# EAGLE design proto (EAGLE 8.7.0)
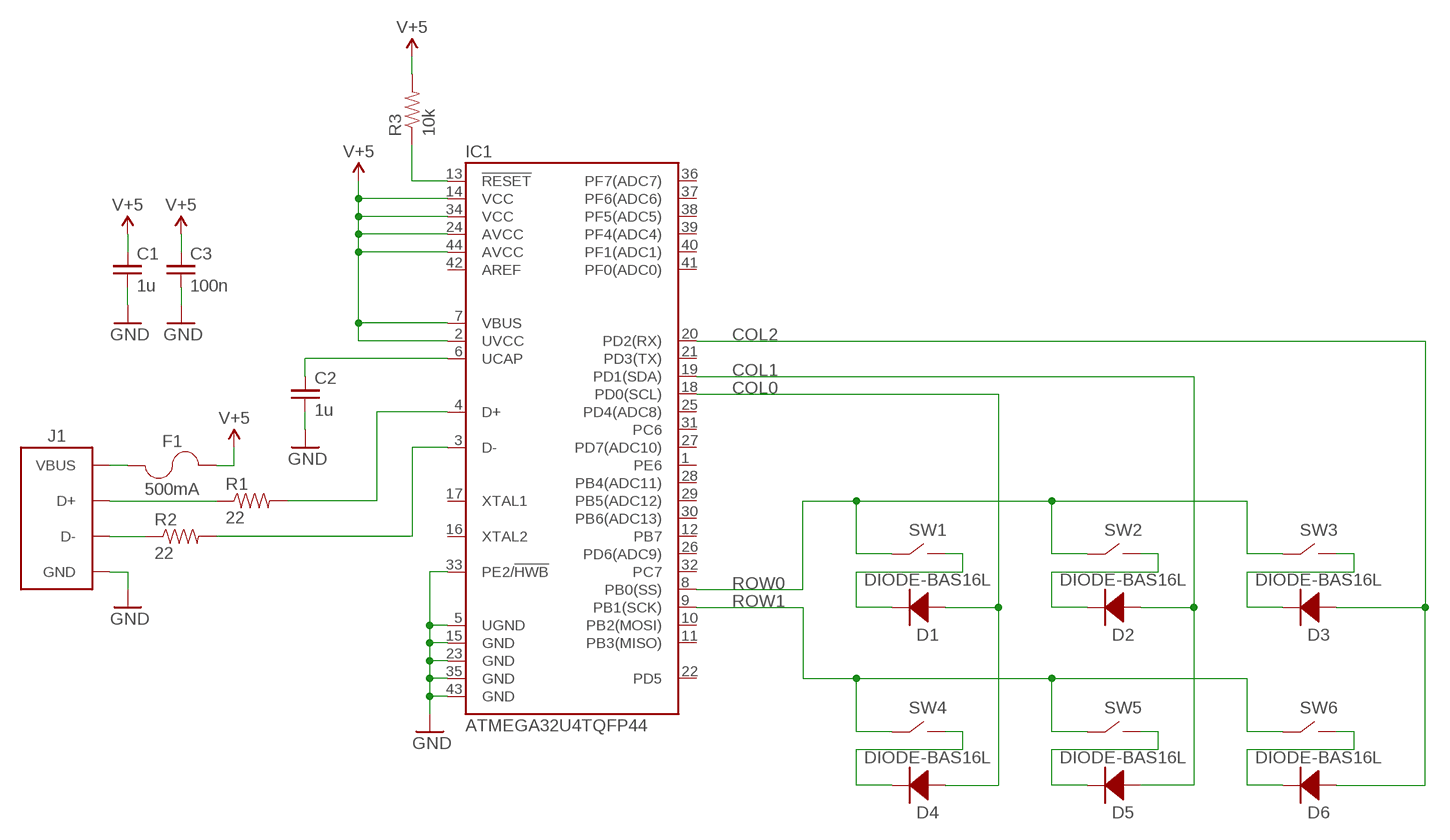
[diagram p0: schematic, sheet 1]

## Parts
C1  1u  CAP-0805  [0805]
C2  1u  CAP-0805  [0805]
C3  100n  CAP-0805  [0805]
D1  DIODE-BAS16L  [SOT23-3]
D2  DIODE-BAS16L  [SOT23-3]
D3  DIODE-BAS16L  [SOT23-3]
D4  DIODE-BAS16L  [SOT23-3]
D5  DIODE-BAS16L  [SOT23-3]
D6  DIODE-BAS16L  [SOT23-3]
F1  500mA  FUSE  [0805]
IC1  ATMEGA32U4TQFP44  [QFP80P1200X1225X120-44]
J1  USB2.0-C  [USB-C]
R1  22  RESISTOR-0805  [0805]
R2  22  RESISTOR-0805  [0805]
R3  10k  RESISTOR-0805  [0805]
SW1  SWITCH-SPSTCHERRY  [CHERRY-MX]
SW2  SWITCH-SPSTCHERRY  [CHERRY-MX]
SW3  SWITCH-SPSTCHERRY  [CHERRY-MX]
SW4  SWITCH-SPSTCHERRY  [CHERRY-MX]
SW5  SWITCH-SPSTCHERRY  [CHERRY-MX]
SW6  SWITCH-SPSTCHERRY  [CHERRY-MX]

## Nets
COL0: D1.1(ANODE+) D4.1(ANODE+) IC1.18(PD0(SCL))
COL1: D2.1(ANODE+) D5.1(ANODE+) IC1.19(PD1(SDA))
COL2: D3.1(ANODE+) D6.1(ANODE+) IC1.20(PD2(RX))
GND: C1.2 C2.2 C3.2 IC1.5(UGND) IC1.15(GND) IC1.23(GND) IC1.33(PE2/!HWB) IC1.35(GND) IC1.43(GND) J1.GND@1(GND) J1.GND@2(GND) J1.GND@3(GND) J1.GND@4(GND) J1.GND@5(GND) J1.GND@6(GND) J1.GND@7(GND) J1.GND@8(GND) J1.GND@9(GND) J1.GND@10(GND) J1.GND@11(GND) J1.GND@12(GND) J1.GND@13(GND) J1.GND@14(GND) J1.GND@15(GND) J1.GND@16(GND)
N$1: J1.D+@1(D+) J1.D+@2(D+) R1.1
N$2: J1.D-@1(D-) J1.D-@2(D-) R2.1
N$3: F1.1 J1.VBUS@1(VBUS) J1.VBUS@2(VBUS) J1.VBUS@3(VBUS) J1.VBUS@4(VBUS)
N$4: C2.1 IC1.6(UCAP)
N$5: IC1.4(D+) R1.2
N$6: IC1.3(D-) R2.2
N$7: IC1.13(!RESET) R3.1
N$8: D1.3(CATHODE-) SW1.P$2
N$9: D2.3(CATHODE-) SW2.P$2
N$10: D3.3(CATHODE-) SW3.P$2
N$11: D4.3(CATHODE-) SW4.P$2
N$12: D5.3(CATHODE-) SW5.P$2
N$13: D6.3(CATHODE-) SW6.P$2
ROW0: IC1.8(PB0(SS)) SW1.P$1 SW2.P$1 SW3.P$1
ROW1: IC1.9(PB1(SCK)) SW4.P$1 SW5.P$1 SW6.P$1
V+5: C1.1 C3.1 F1.2 IC1.2(UVCC) IC1.7(VBUS) IC1.14(VCC) IC1.24(AVCC) IC1.34(VCC) IC1.44(AVCC) R3.2
Unconnected: IC1.1(PE6) IC1.10(PB2(MOSI)) IC1.11(PB3(MISO)) IC1.12(PB7) IC1.16(XTAL2) IC1.17(XTAL1) IC1.21(PD3(TX)) IC1.22(PD5) IC1.25(PD4(ADC8)) IC1.26(PD6(ADC9)) IC1.27(PD7(ADC10)) IC1.28(PB4(ADC11)) IC1.29(PB5(ADC12)) IC1.30(PB6(ADC13)) IC1.31(PC6) IC1.32(PC7) IC1.36(PF7(ADC7)) IC1.37(PF6(ADC6)) IC1.38(PF5(ADC5)) IC1.39(PF4(ADC4)) IC1.40(PF1(ADC1)) IC1.41(PF0(ADC0)) IC1.42(AREF)

## Library data of the parts
C1-C3 = passives:CAP: AC capacitor 0805 <http://www.digikey.com/product-search/en/capacitors/ceramic-capacitors/131083?k=&pv17=18&pv17=5&FV=fffc04fc%2C1c0002%2C380020%2C400006%2C11401c5%2C6540013%2Cfff40002%2Cfff8000b&mnonly=0&newproducts=0&ColumnSort=1000011&page=1&stock=1&pbfree=1&rohs=1&quantity=1&ptm=0&fid=0&pageSize=500>
D1-D6 = discrete:DIODE-BAS16L
F1 = passives:FUSE: LED 500mA SMD 0805 Vishay Beyschlag MFU0805FF00500P100 MFU0805.50CT-ND <https://www.digikey.com/products/en/circuit-protection/fuses/139?k=&pkeyword=&pv16=6&FV=1140003%2Cmu500mA%7C2088%2Cffe0008b%2C1c0002&quantity=0&ColumnSort=0&page=1&stock=1&pageSize=500>
IC1 = ICs:ATMEGA32U4
J1 = connector:USB2.0-C
R1-R3 = passives:RESISTOR: Resistor 0805 <http://www.digikey.com/product-search/en/resistors/chip-resistor-surface-mount/65769?FV=fffc000a%2C80005%2Cc0002%2C1c0002%2C400006%2C52403b5%2Cfff40001%2Cfff800e9&mnonly=0&newproducts=0&ColumnSort=1000011&page=1&stock=1&pbfree=1&rohs=1&k=&quantity=1&ptm=0&fid=0&pageSize=500>
SW1-SW6 = passives:SWITCH-SPST: Small push button switch TE Connectivity Alcoswitch Switches 1825910-6 450-1650-ND <http://www.digikey.com/product-detail/en/te-connectivity-alcoswitch-switches/1825910-6/450-1650-ND/1632536> Cherry MX keyboard switch

## Board
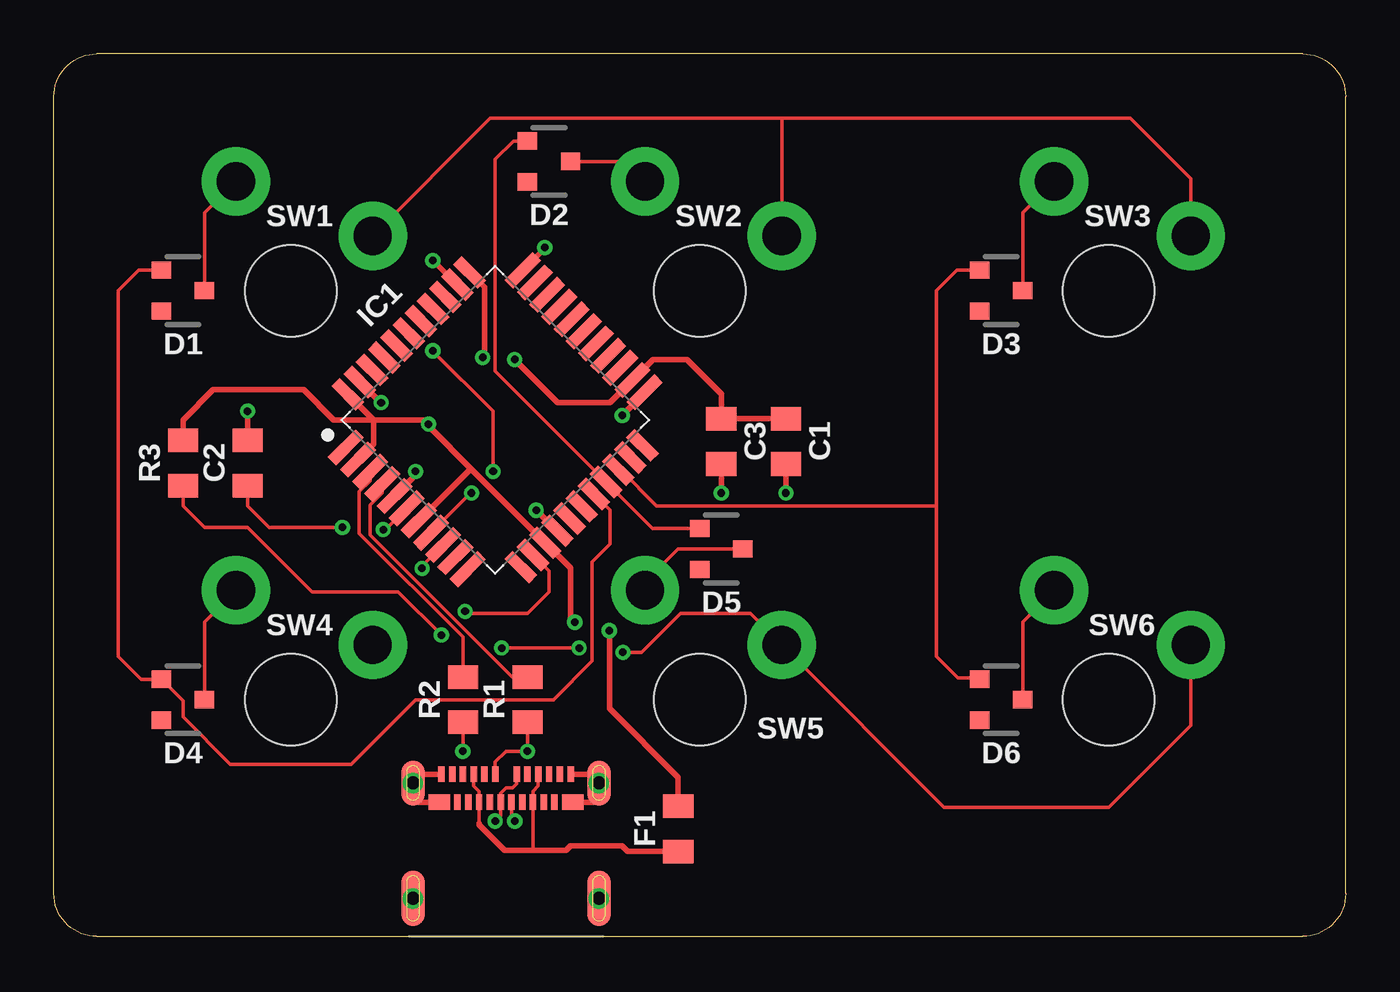
[diagram p1: board, top side]
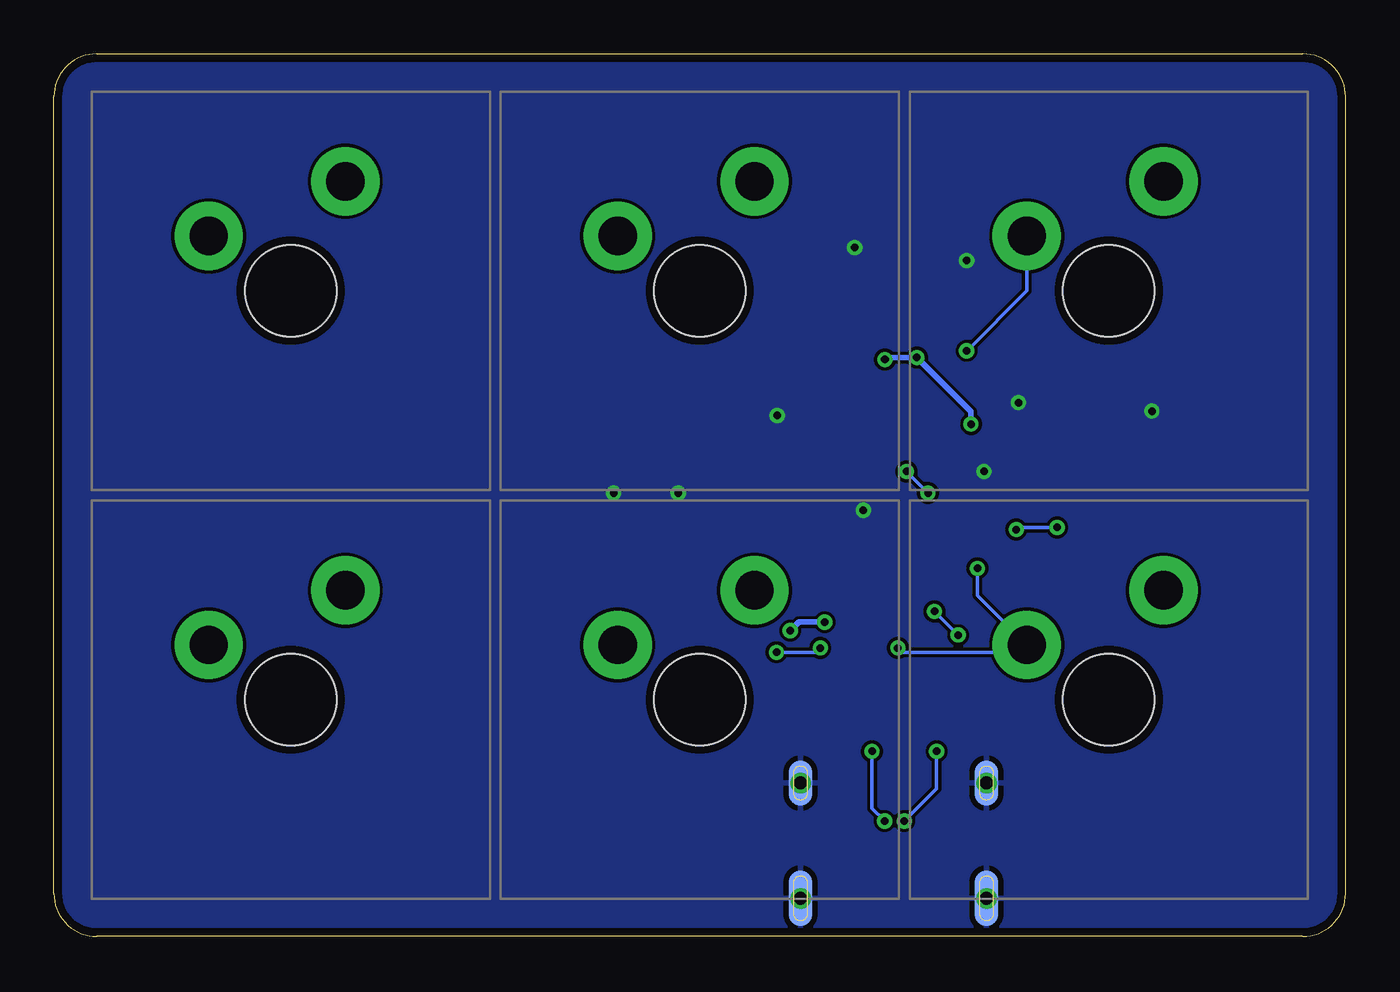
[diagram p2: board, bottom side, seen from below]

Size 60 x 41 mm. Coordinates in mm from the lower left corner, seen from the top.
Outline: 2,0 58,0 arc90 60,2 60,39 arc90 58,41 2,41 arc90 0,39 0,2 arc90 2,0
Copper layers (1*16): Top 0.035mm / dielectric 1.53mm / Bottom 0.035mm
Design rules "PCBMinions_2_layer_1.6mm_6-6": minimum track width 6mil, minimum drill 12mil, track to track 6mil, track to pad 6mil, pad to pad 6mil, via to via 6mil, smd to smd 6mil, copper to edge 15mil, drill to drill 6mil, minimum pad ring 7mil, minimum via ring 7mil, stop-mask expansion 3mil, vias tented up to drill 25mil, thermal gap 10mil

### Footprints (pad centres in the part's own frame; a part is rotated, then mirrored left to right if it is on the bottom)
0805 = smd 1.092 x 1.397: 1 -1.054,0; 2 1.054,0
SOT23-3 = smd 0.899 x 0.8: 1 1.001,-0.95; 2 1.001,0.95; 3 -1.001,0
QFP80P1200X1225X120-44 = smd 1.828 x 0.547: 1 -5.814,4; 2 -5.814,3.2; 3 -5.814,2.4; 4 -5.814,1.6; 5 -5.814,0.8; 6 -5.814,0; 7 -5.814,-0.8; 8 -5.814,-1.6; 9 -5.814,-2.4; 10 -5.814,-3.2; 11 -5.814,-4; 23 5.814,-4; 24 5.814,-3.2; 25 5.814,-2.4; 26 5.814,-1.6; 27 5.814,-0.8; 28 5.814,0; 29 5.814,0.8; 30 5.814,1.6; 31 5.814,2.4; 32 5.814,3.2; 33 5.814,4 | smd 0.547 x 1.6: 12 -4,-5.681; 13 -3.2,-5.681; 14 -2.4,-5.681; 15 -1.6,-5.681; 16 -0.8,-5.681; 17 0,-5.681; 18 0.8,-5.681; 19 1.6,-5.681; 20 2.4,-5.681; 21 3.2,-5.681; 22 4,-5.681; 34 4,5.681; 35 3.2,5.681; 36 2.4,5.681; 37 1.6,5.681; 38 0.8,5.681; 39 0,5.681; 40 -0.8,5.681; 41 -1.6,5.681; 42 -2.4,5.681; 43 -3.2,5.681; 44 -4,5.681
USB-C = smd 0.3 x 0.7: CC1 -1,7.54; CC2 0.75,6.24; D+@1 -0.5,7.54; D+@2 0.25,6.24; D-@1 0.5,7.54; D-@2 -0.25,6.24; GND@1 -3,7.54; GND@2 3,7.54; RX1+ -2.25,6.24; RX1- -1.75,6.24; RX2+ 2.5,7.54; RX2- 2,7.54; SBU1 1,7.54; SBUS2 -0.75,6.24; TX1+ -2.5,7.54; TX1- -2,7.54; TX2+ 2.25,6.24; TX2- 1.75,6.24; VBUS@1 -1.5,7.54; VBUS@2 1.5,7.54; VBUS@3 -1.25,6.24; VBUS@4 1.25,6.24 | smd 1 x 0.7: GND@3 -3.1,6.24; GND@4 3.1,6.24 | smd 1.1 x 2.6: GND@5 -4.32,1.77; GND@7 4.32,1.77 | smd 1.1 x 2.6 bottom: GND@6 -4.32,1.77; GND@8 4.32,1.77 | smd 1.1 x 2.1: GND@9 -4.32,7.13; GND@11 4.32,7.13 | smd 1.1 x 2.1 bottom: GND@10 -4.32,7.13; GND@12 4.32,7.13 | drill 0.6: GND@13 -4.32,1.77; GND@14 4.32,1.77; GND@15 -4.32,7.13; GND@16 4.32,7.13
CHERRY-MX = drill 1.778 pad 3.175: P$1 -3.81,2.54; P$2 2.54,5.08 | hole 4.242: 0,0

### Placement (x,y rotation side)
C1  34,23 270 top
C2  9,22 90 top
C3  31,23 270 top
D1  6,30 180 top
D2  23,36 180 top
D3  44,30 180 top
D4  6,11 180 top
D5  31,18 180 top
D6  44,11 180 top
F1  29,5 90 top
IC1  20.5,24 45 top
J1  21,0 0 top
R1  22,11 90 top
R2  19,11 90 top
R3  6,22 90 top
SW1  11,30 0 bottom
SW2  30,30 0 bottom
SW3  49,30 0 bottom
SW4  11,11 0 bottom
SW5  30,11 0 bottom
SW6  49,11 0 bottom

### Tracks (layer width: path | path; a pad name or v marks a point on that pad's centre or on a via)
COL0
  Top 0.152: D1.1 3.95,30.95 3,30 3,13 4.05,11.95 D4.1 6,10.95 6,10.2 8.2,8 13.8,8 16.8,11 23.2,11 25,12.8 25,17.4 25.83,18.23 25.83,19.8 IC1.18
COL1
  Top 0.152: D2.1 21.35,36.95 20.5,36.1 20.5,26.26 IC1.19 27.81,18.95 D5.1
COL2
  Top 0.152: D6.1 42.95,12 42,12 41,13 41,20 | D3.1 41.95,30.95 41,30 41,20 | IC1.20 26.32,21.68 28,20 41,20
GND  (via drill 0.35)
  Top 0.254: IC1.5 16.8,21.43 v16.8,21.6 | IC1.43 15.18,24.8 v15.2,24.8 | IC1.33 22.8,31.96 v22.8,32 | IC1.35 17.62,31.4 v17.6,31.4 | C3.2 v31,20.6 | C1.2 v34,20.6 | IC1.23 27.44,25.24 v26.4,24.2 | IC1.15 23.35,18.85 v22.4,19.8 | C2.2 v9,24.4 | J1.GND@3 16.96,6.24 16.68,6.52 J1.GND@15 17.09,7.54 J1.GND@1 | J1.GND@4 25.04,6.24 25.4,6.6 25.32,6.68 J1.GND@16 24.91,7.54 J1.GND@2
  pour Bottom: 0,0 0,41 60,41 60,0
N$1  (via drill 0.35)
  Top 0.152: R1.1 v22,8.6 21,8.6 20.5,8.1 J1.D+@1 | J1.D+@2 21.25,5.52 v21.41,5.36
  Bottom 0.152: v22,8.6 22,5.95 v21.41,5.36
N$2  (via drill 0.35)
  Top 0.152: J1.D-@1 21.5,7.1 21.3,6.9 21,6.9 20.75,6.65 J1.D-@2 20.75,5.61 v20.5,5.36 | R2.1 v19,8.6
  Bottom 0.152: v19,8.6 19,6.86 v20.5,5.36
N$3
  Top 0.152: J1.VBUS@2 22.5,7 22.25,6.75 J1.VBUS@4 22.25,4.05 22.3,4 | J1.VBUS@1 19.5,7 19.75,6.75 J1.VBUS@3 19.75,5.25
  Top 0.254: 28.95,4 F1.1 26.65,3.95 26.4,4.2 24,4.2 23.8,4 22.3,4 20.93,4 19.75,5.18 19.75,5.25
N$4  (via drill 0.35)
  Top 0.152: IC1.6 15.4,18.9 v15.3,18.9 | v13.4,19 10,19 9,20 C2.1
  Bottom 0.152: v15.3,18.9 15.2,19 v13.4,19
N$5
  Top 0.152: IC1.4 15.26,20.6 14.69,20.04 14.69,18.65 21.29,12.05 R1.2
N$6
  Top 0.152: IC1.3 14.69,21.16 14.19,20.66 14.19,18.72 19,13.91 R2.2
N$7  (via drill 0.35)
  Top 0.152: R3.1 6,20 7,19 9,19 12,16 16,16 v18,14 | IC1.13 23,16.98 23,16 22,15 19.2,15 v19.1,15.1
  Bottom 0.152: v18,14 v19.1,15.1
N$8
  Top 0.152: D1.3 7,33.62 SW1.P$2
N$9
  Top 0.152: SW2.P$2 26.54,36 D2.3
N$10
  Top 0.152: D3.3 45,33.62 SW3.P$2
N$11
  Top 0.152: D4.3 7,14.62 SW4.P$2
N$12
  Top 0.152: D5.3 29,18 27.46,16.46 SW5.P$2
N$13
  Top 0.152: D6.3 45,14.62 SW6.P$2
ROW0  (via drill 0.35)
  Top 0.152: SW3.P$1 52.81,35.19 50,38 33.8,38 | SW1.P$1 20.27,38 33.8,38 | 33.8,38 33.81,37.99 SW2.P$1 | IC1.8 19.36,20.6 v19.4,20.6 | v20.4,21.6 20.4,24.4 v17.6,27.2
  Bottom 0.152: v19.4,20.6 v20.4,21.6 | v17.6,27.2 14.81,29.99 SW1.P$1
ROW1  (via drill 0.35)
  Top 0.152: SW6.P$1 52.81,9.81 49,6 41.35,6 SW5.P$1 32.35,15 29.1,15 27.3,13.2 v26.43,13.2 | IC1.9 17.1,17.21 v17.1,17.1 | v20.8,13.4 v24.4,13.4
  Bottom 0.152: v17.1,17.1 17.1,15.83 SW4.P$1 15.15,13.2 20.6,13.2 v20.8,13.4 | v24.4,13.4 24.6,13.2 v26.43,13.2
V+5  (via drill 0.35)
  Top 0.254: R3.2 6,24 7.4,25.4 11.6,25.4 13,24 14.84,24 | IC1.44 14.84,24 | IC1.2 14.84,22.87 14.84,24 | IC1.34 20,30.16 20,26.98 | 31,24.2 31,25.2 29.4,26.8 27.82,26.8 IC1.24 25.82,24.8 23.4,24.8 v21.4,26.8 | 31,24.2 C3.1 | C1.1 31.15,24.05 31,24.2 | 20,26.98 v19.92,26.89 | 20,26.89 20,26.98 | 19.45,21.65 IC1.14 24,17.11 24,14.8 v24.2,14.6 | 19.45,21.65 17.4,23.71 v17.4,23.8 17.2,24 14.84,24 | IC1.7 19.28,21.65 19.45,21.65 | v25.8,14.2 25.8,10.6 29,7.4 F1.2
  Bottom 0.254: v21.4,26.8 21.31,26.89 v19.92,26.89 17.4,24.38 v17.4,23.8 | v25.8,14.2 25.4,14.6 v24.2,14.6

### Text on the board
tStop: March 2018 / Ben Shanahan / Jacob Feder